# EAGLE design programmer (EAGLE 6.1)
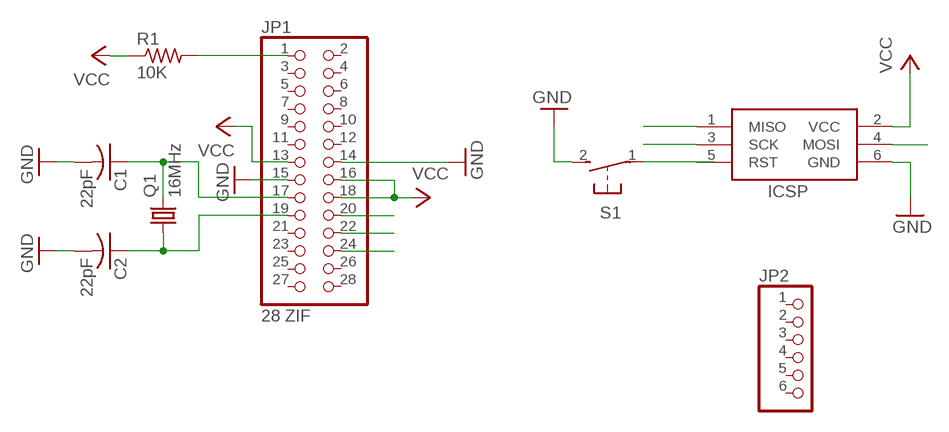
[diagram p0: schematic, sheet 1]

## Parts
C1  22pF  C-US025-025X050  [C025-025X050]
C2  22pF  C-US025-025X050  [C025-025X050]
ICSP  AVRISP-6  [AVRISP]
JP1  28 ZIF  PINHD-2X14  [2X14]
JP2  PINHD-1X6  [1X06]
Q1  16MHz  CRYSTALHC49S  [HC49/S]
R1  10K  R-US_0207/10  [0207/10]
S1  31-XX  [B3F-31XX]

## Nets
GND: C1.2 C2.2 ICSP.6(GND) JP1.14 JP1.15 S1.2(S)
MISO: ICSP.1(MISO) JP1.22
MOSI: ICSP.4(MOSI) JP1.24
N$1: C1.1 JP1.17 Q1.2
N$2: C2.1 JP1.19 Q1.1
RESET: JP1.1 R1.2 S1.1(P)
SCK: ICSP.3(SCK) JP1.20
VCC [vcc]: ICSP.2(VCC) JP1.13 JP1.16 JP1.18 R1.1
Unconnected: ICSP.5(RST) JP1.2 JP1.3 JP1.4 JP1.5 JP1.6 JP1.7 JP1.8 JP1.9 JP1.10 JP1.11 JP1.12 JP1.21 JP1.23 JP1.25 JP1.26 JP1.27 JP1.28 JP2.1 JP2.2 JP2.3 JP2.4 JP2.5 JP2.6

## Library data of the parts
C1 C2 = resistor:C-US: CAPACITOR, American symbol
ICSP = adafruit:AVRISP: AVR ISP HEADER Standard 6 pin header for AVR programming
JP1 = adafruit:PINHD-2X14: PIN HEADER
JP2 = adafruit:PINHD-1X6: PIN HEADER
Q1 = crystal:CRYSTAL: CRYSTAL; OC_FARNELL: 1667008; OC_NEWARK: unknown
R1 = resistor:R-US_: RESISTOR, American symbol
S1 = adafruit:31-XX: OMRON SWITCH Now with beefier pads!

## Net classes
1 vcc: width 0.203 mm, drill 0.152 mm, clearance 0.152 mm

## Board
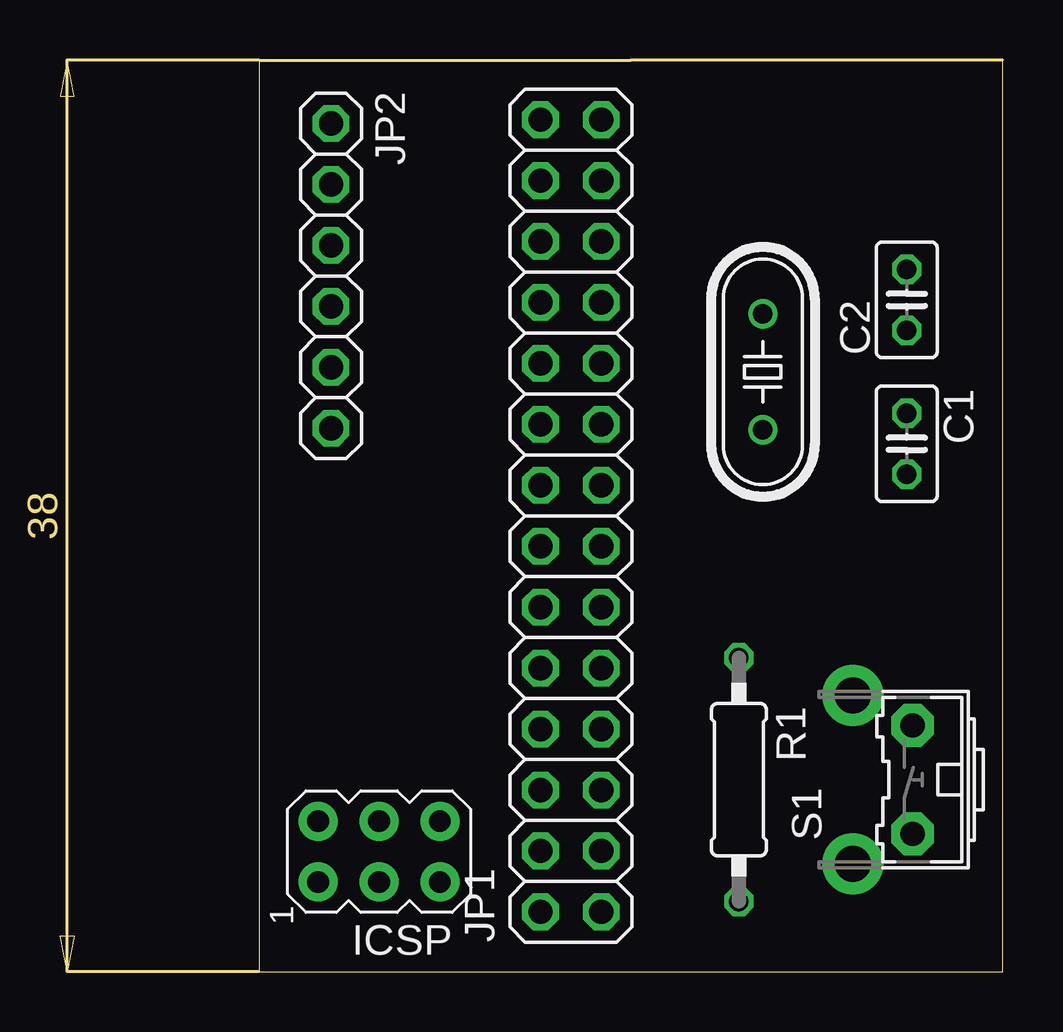
[diagram p1: board, top side]
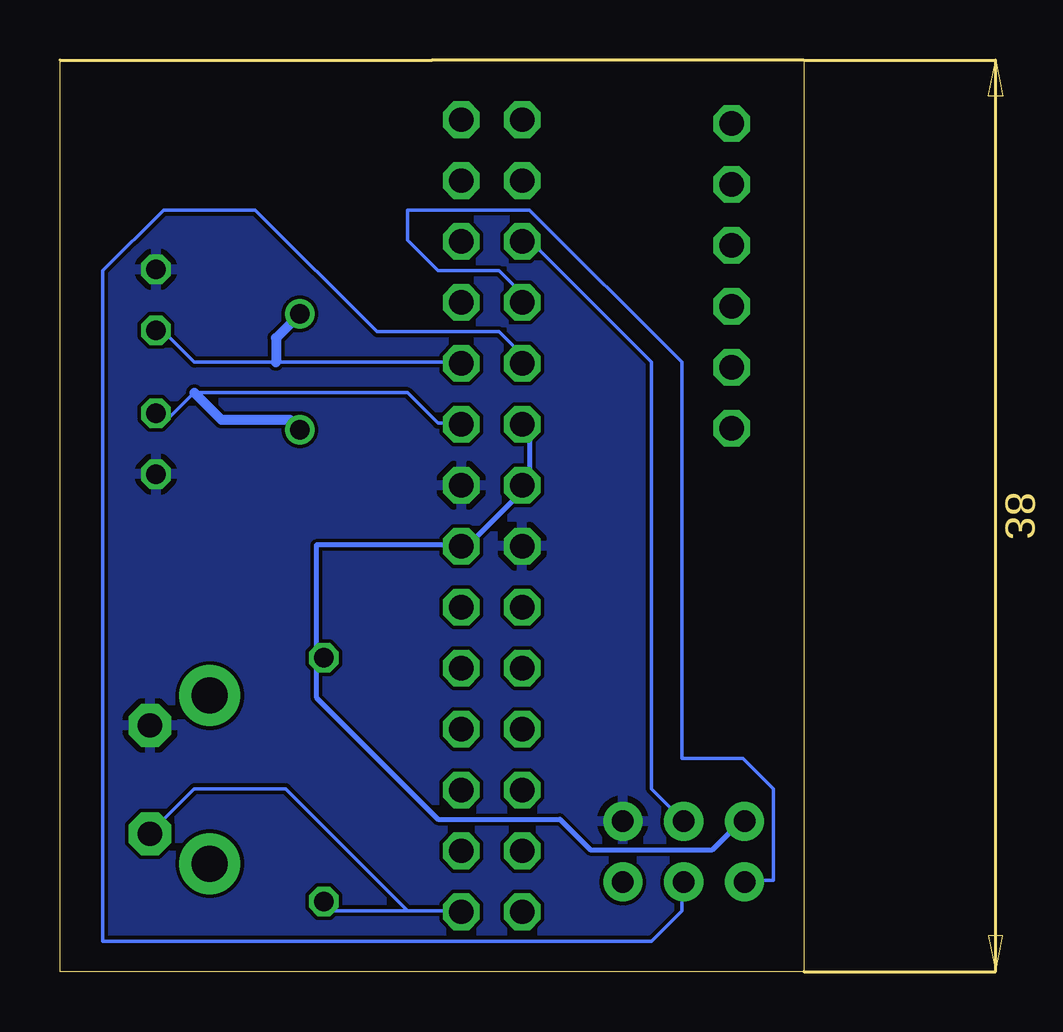
[diagram p2: board, bottom side, seen from below]

Size 31 x 38 mm. Coordinates in mm from the lower left corner, seen from the top.
Outline: 0,0 31,0 31,38 0,38 0,0
Copper layers (1*16): Top 0.0356mm / dielectric 1.5011mm / Bottom 0.0356mm
Design rules: minimum track width 6mil, minimum drill 13mil, track to track 6mil, track to pad 6mil, pad to pad 6mil, via to via 6mil, smd to smd 6mil, copper to edge 15mil, drill to drill 6mil, minimum pad ring 7mil, minimum via ring 7mil, stop-mask expansion 4mil, vias tented up to drill 0mil, thermal gap 10mil

### Footprints (pad centres in the part's own frame; a part is rotated, then mirrored left to right if it is on the bottom)
C025-025X050 = drill 0.813 octagon: 1 -1.27,0; 2 1.27,0
AVRISP = drill 0.9 pad 1.626: 1 -1.27,2.54; 2 1.27,2.54; 3 -1.27,0; 4 1.27,0; 5 -1.27,-2.54; 6 1.27,-2.54
2X14 = drill 1.016 octagon: 1 -16.51,-1.27; 2 -16.51,1.27; 3 -13.97,-1.27; 4 -13.97,1.27; 5 -11.43,-1.27; 6 -11.43,1.27; 7 -8.89,-1.27; 8 -8.89,1.27; 9 -6.35,-1.27; 10 -6.35,1.27; 11 -3.81,-1.27; 12 -3.81,1.27; 13 -1.27,-1.27; 14 -1.27,1.27; 15 1.27,-1.27; 16 1.27,1.27; 17 3.81,-1.27; 18 3.81,1.27; 19 6.35,-1.27; 20 6.35,1.27; 21 8.89,-1.27; 22 8.89,1.27; 23 11.43,-1.27; 24 11.43,1.27; 25 13.97,-1.27; 26 13.97,1.27; 27 16.51,-1.27; 28 16.51,1.27
1X06 = drill 1.016 octagon: 1 -6.35,0; 2 -3.81,0; 3 -1.27,0; 4 1.27,0; 5 3.81,0; 6 6.35,0
HC49/S = drill 0.813: 1 -2.413,0; 2 2.413,0
0207/10 = drill 0.813 octagon: 1 -5.08,0; 2 5.08,0
B3F-31XX = drill 1.016 pad 1.778 octagon: 1 -2.261,-1.245; 2 2.261,-1.245 | drill 1.499 pad 2.54: 3 -3.505,1.245; 4 3.505,1.245

### Placement (x,y rotation side)
C1  27,22 270 top
C2  27,28 90 top
ICSP  5,5 90 top
JP1  13,19 90 top
JP2  3,29 270 top
Q1  21,25 270 top
R1  20,8 270 top
S1  26,8 90 top

### Tracks (layer width: path | path; a pad name or v marks a point on that pad's centre or on a via)
GND
  pour Bottom: 1.27,37.1 30,37 30,1 1.27,1.27
MISO
  Bottom 0.152: JP1.22 11.43,27.94 12.7,29.21 15.24,29.21 16.51,30.48 16.51,31.75 11.43,31.75 5.08,25.4 5.08,8.89 2.54,8.89 1.27,7.62 1.27,3.81 2.54,3.81 ICSP.1
MOSI
  Bottom 0.152: ICSP.4 6.35,7.62 6.35,25.4 11.43,30.48 JP1.24
N$1
  Bottom 0.152: C1.1 26.67,22.86 25.4,24.13 16.51,24.13 15.24,22.86 13.97,22.86 JP1.17
  Bottom 0.406: Q1.2 21.41,23 24.27,23 25.4,24.13
N$2
  Bottom 0.152: C2.1 26.67,26.67 25.4,25.4 22,25.4 13.97,25.4 JP1.19
  Bottom 0.406: Q1.1 22,26.41 22,25.4
RESET
  Bottom 0.152: 16.51,2.54 13.97,2.54 JP1.1 | 16.51,2.54 20.32,2.54 R1.2 | 16.51,2.54 21.59,7.62 25.4,7.62 26.67,6.35 S1.1
SCK
  Bottom 0.152: JP1.20 11.43,25.4 12.7,26.67 17.78,26.67 22.86,31.75 26.67,31.75 29.21,29.21 29.21,1.27 6.35,1.27 5.08,2.54 5.08,3.81 ICSP.3
VCC
  Bottom 0.203: 11.43,20.32 11.43,22.86 JP1.18 | 20.32,12.7 20.32,17.78 13.97,17.78 | 20.32,12.7 20.32,11.43 15.24,6.35 10.16,6.35 8.89,5.08 3.81,5.08 2.54,6.35 ICSP.2 | 20.32,12.7 R1.1 | 13.97,17.78 11.43,20.32 | 11.43,20.32 JP1.16 | 13.97,17.78 JP1.13